# Altium schematic sheet Power Board.1.SchDoc
size A4; SheetNumber: 1; SheetTotal: 2
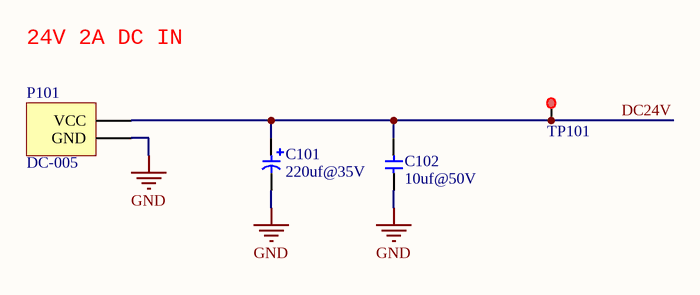
[diagram p0: Power Board.1.SchDoc]

## Parts
C101  value 220uf@35V  [C8X12]  (hidden comment: Cap2)
C102  value 10uf@50V  [C1206]  (hidden comment: Cap)
P101  DC-005  [DC-005]
TP101  TestPoint  [TestPoint-SMD100]  (value not drawn)

## Nets
GND: C101.2 C102.1 P101.2(GND)
DC24V: C101.1 C102.2 P101.1(VCC) TP101.1

## Notes on the sheet
- 24V 2A DC IN

## Library data of the parts
TP101 = TestPoint: 测试点